# Altium schematic sheet title_sheet.SchDoc: TITLE SHEET
size A4; Organization: Altium Limited; Address1: L3, 12a Rodborough Rd; Address2: Frenchs Forest; Address3: NSW; Address4: Australia 2086; DocumentNumber: 1; Revision: 1
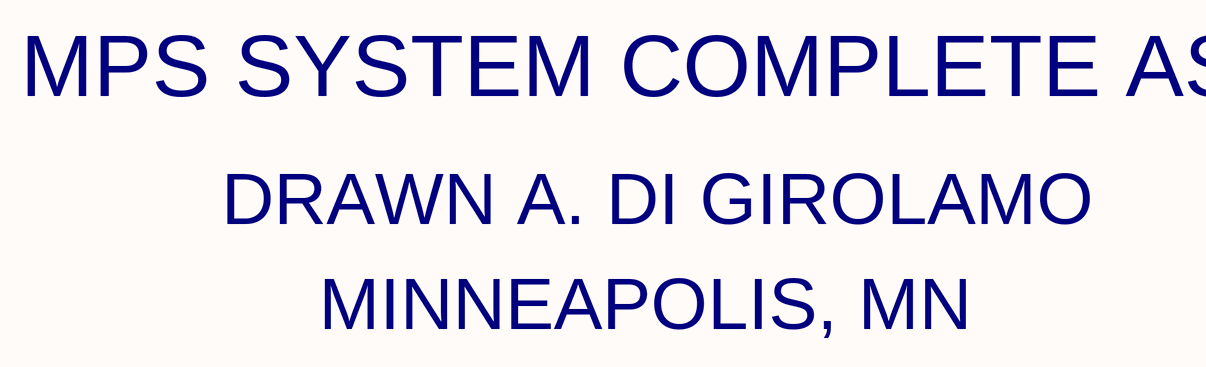
[diagram p0: title_sheet.SchDoc]

## Notes on the sheet
- MPS SYSTEM COMPLETE ASSY
- DRAWN A. DI GIROLAMO
- MINNEAPOLIS, MN
- Title
- Date:
- RE:
- Arturo di Girolamo
- Size:
- A3
- A